# EAGLE design sterowanie (EAGLE 7.2.0)
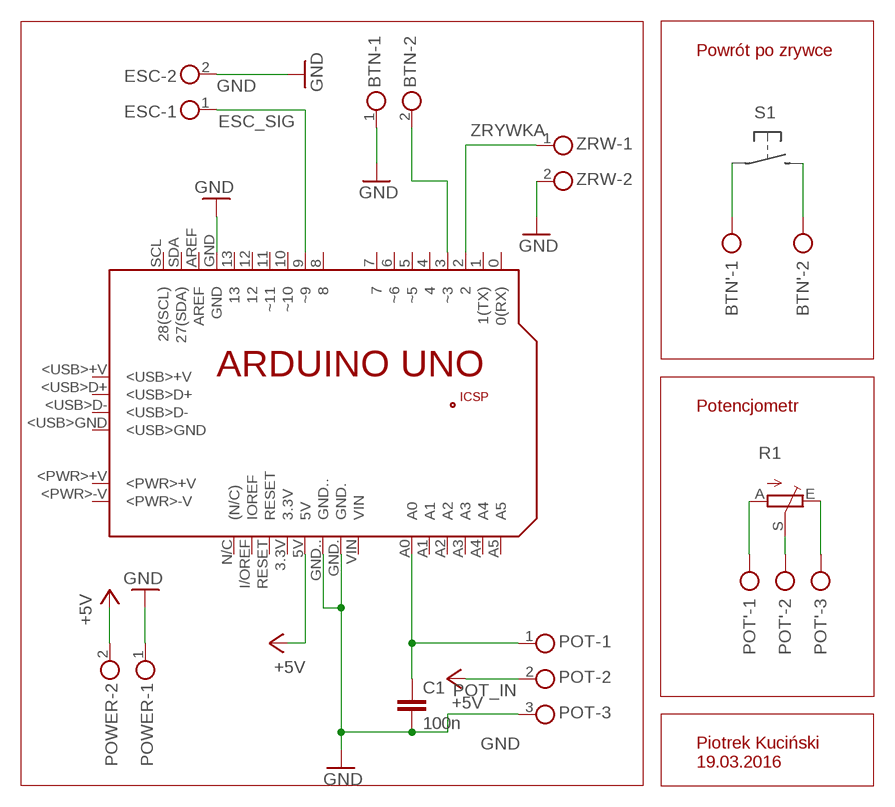
[diagram p0: schematic, sheet 1]

## Parts
BTN  AKL59-02  [2POL35]
BTN'  AK300/2  [AK300/2]
C1  100n  C-EUC1206  [C1206]
ESC  AKL59-02  [2POL35]
PCB1  ARDUINO_UNO  [ARDUINO_UNO]
POT  AKL59-03  [3POL35]
POT'  AK300/3  [AK300/3]
POWER  AKL59-02  [2POL35]
R1  TRIM_EU-B90P  [SP19L]
ZRW  AKL59-02  [2POL35]

## Nets
+5V: PCB1.5V POT.2 POWER.2
ESC_SIG: ESC.1 PCB1.9(~9)
GND: BTN.1 C1.2 ESC.2 PCB1.GND PCB1.GND. PCB1.GND.. POT.3 POWER.1 ZRW.2
N$1: BTN.2 PCB1.3(~3)
N$2: BTN'.1
N$3: BTN'.2
N$4: POT'.3 R1.E
N$5: POT'.1 R1.A
N$6: POT'.2 R1.S
POT_IN: C1.1 PCB1.A0 POT.1
ZRYWKA: PCB1.2 ZRW.1
Unconnected: PCB1.0(0(RX)) PCB1.1(1(TX)) PCB1.3.3V PCB1.4 PCB1.5(~5) PCB1.6(~6) PCB1.7 PCB1.8 PCB1.10(~10) PCB1.11(~11) PCB1.12 PCB1.13 PCB1.+5V PCB1.<PWR>+V PCB1.<PWR>-V PCB1.<USB>+V PCB1.<USB>D+ PCB1.<USB>D- PCB1.<USB>GND PCB1.A1 PCB1.A2 PCB1.A3 PCB1.A4 PCB1.A5 PCB1.AREF PCB1.GND_ PCB1.I/OREF(IOREF) PCB1.MISO PCB1.MOSI PCB1.N/C((N/C)) PCB1.RESET PCB1.RESET. PCB1.SCK PCB1.SCL(28(SCL)) PCB1.SDA(27(SDA)) PCB1.VIN

## Notes on the sheet
- Powrót po zrywce
- Potencjometr
- Piotrek Kuciński
  19.03.2016

## Library data of the parts
BTN ESC POWER ZRW = con-ria-59:AKL59-02: RIA Anschlussklemme Typ 59, Raster 3,5 mm, Polzahl 2
BTN' = con-ptr500:AK300/2: CONNECTOR; OC_FARNELL: unknown; OC_NEWARK: unknown
C1 = rcl:C-EU: CAPACITOR, European symbol
PCB1 = E14_Arduino_revB:ARDUINO_UNO: Device for representing an Arduino Uno board with a footprint in an EAGLE design. Created by Dave Young for Element14. More EAGLE documentation at: http://www.element14.com/community/community/knode/cadsoft_eagle
POT = con-ria-59:AKL59-03: RIA Anschlussklemme Typ 59, Raster 3,5 mm, Polzahl 3
POT' = con-ptr500:AK300/3: CONNECTOR; OC_FARNELL: unknown; OC_NEWARK: unknown
R1 = pot:TRIM_EU-: POTENTIOMETER

## Board
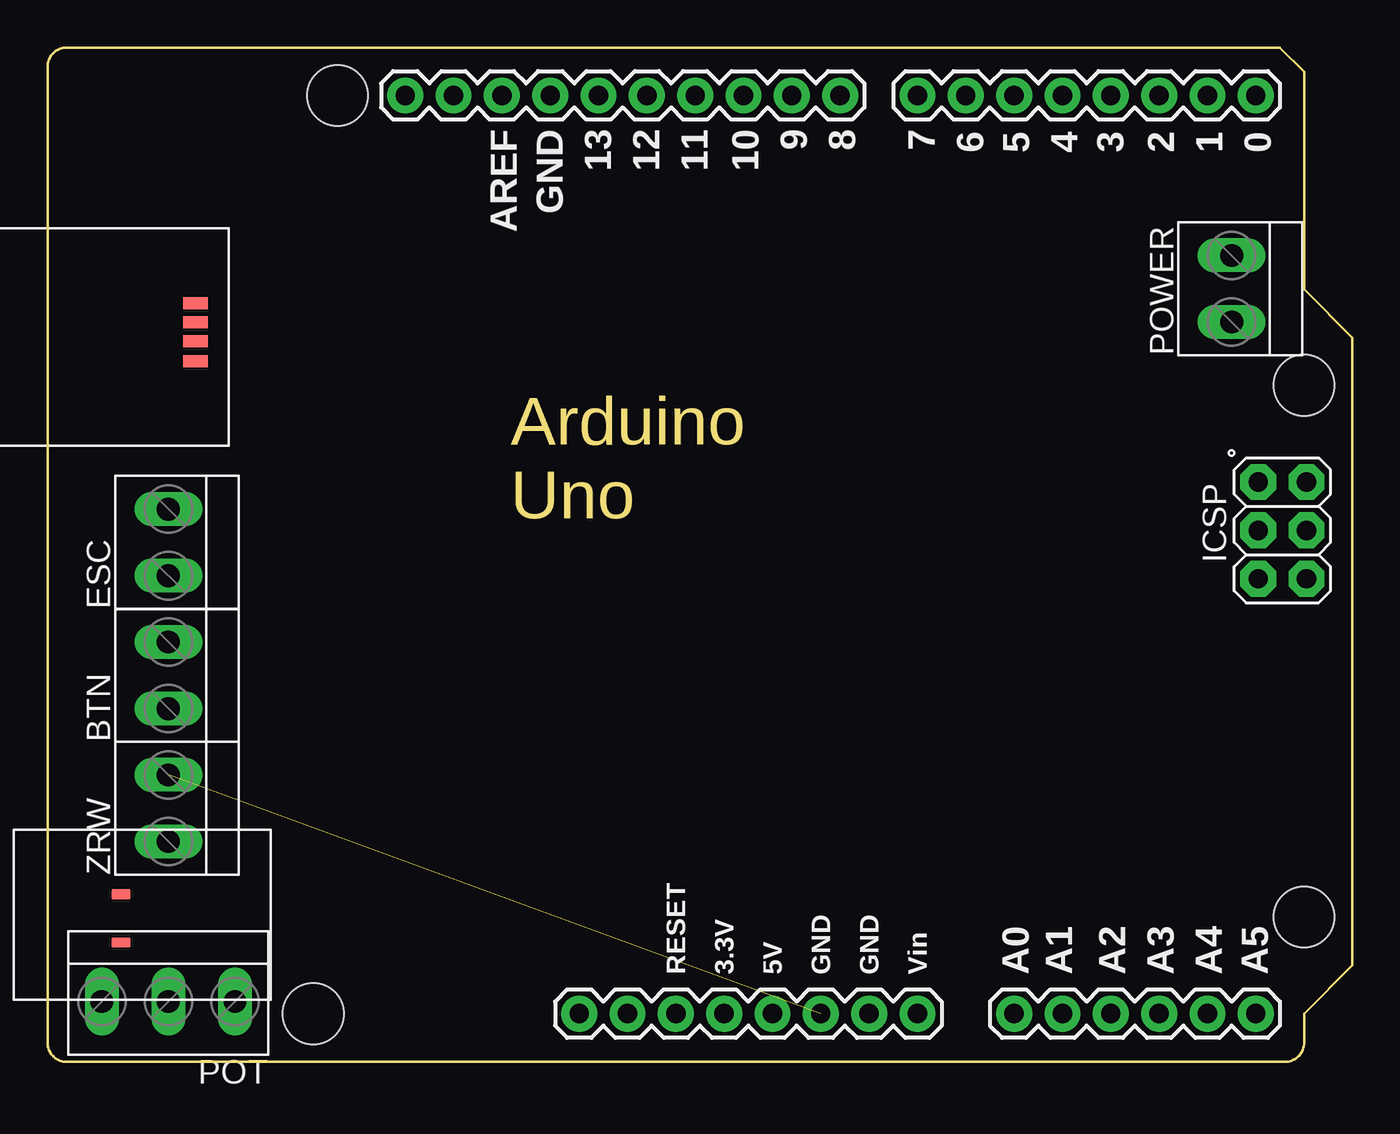
[diagram p1: board, top side]
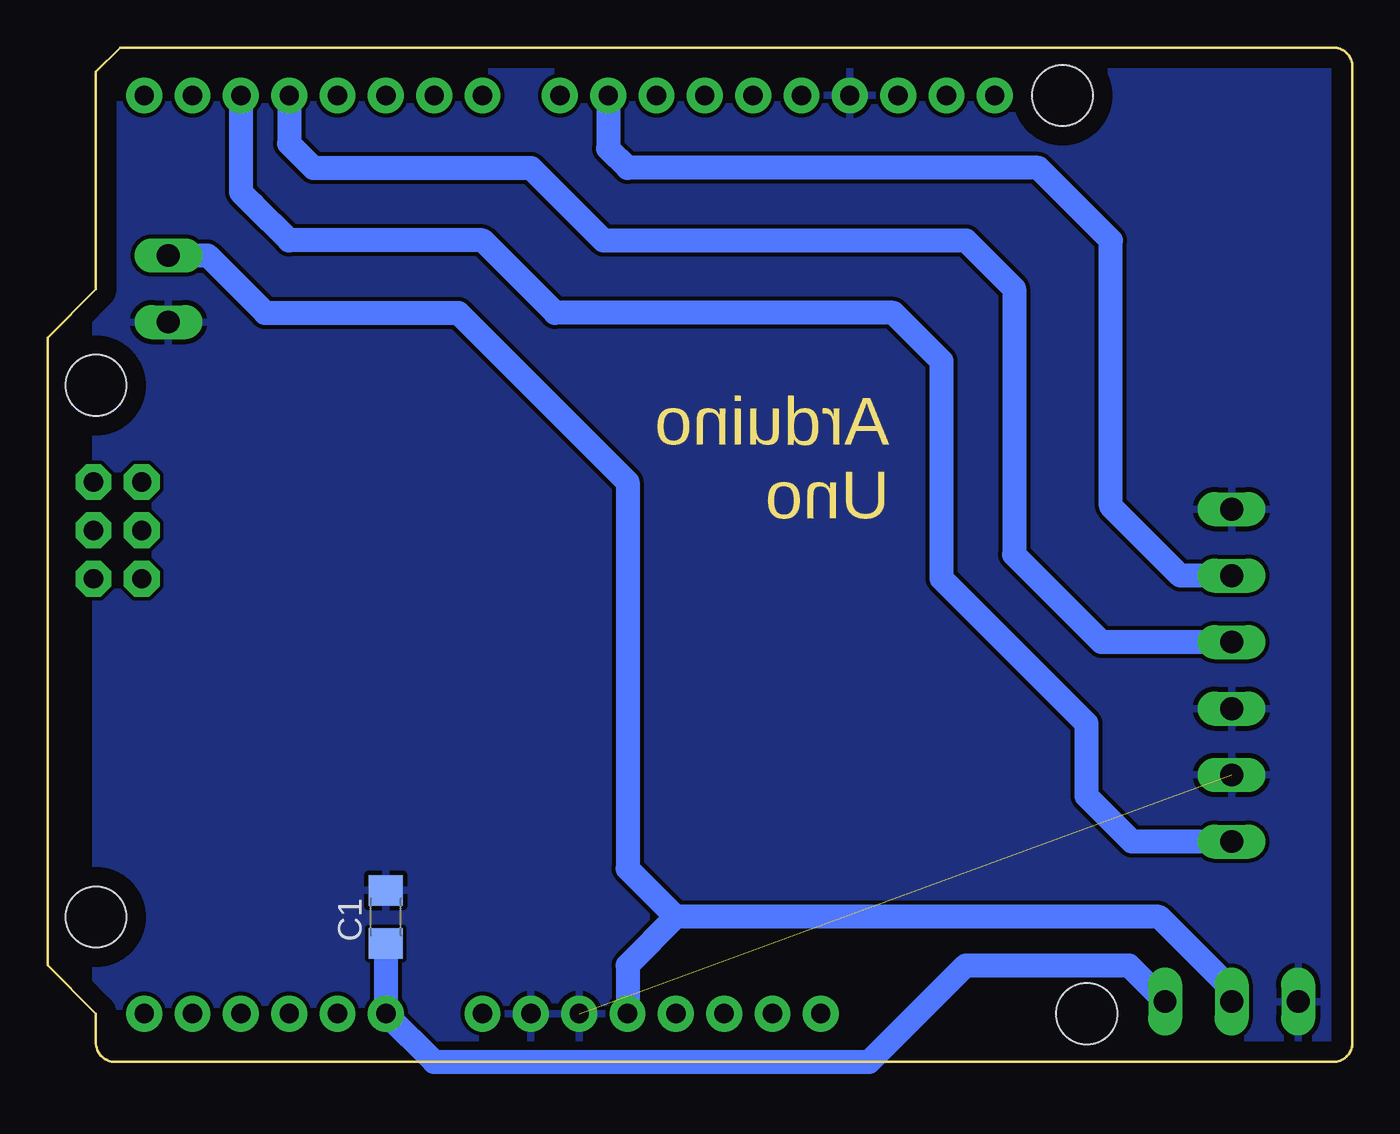
[diagram p2: board, bottom side, seen from below]

Size 68.58 x 53.31 mm. Coordinates in mm from the lower left corner, seen from the top.
Copper layers (1*16): Top 0.035mm / dielectric 1.5mm / Bottom 0.035mm
Design rules "default": minimum track width 10mil, minimum drill 24mil, track to track 8mil, track to pad 8mil, pad to pad 8mil, via to via 8mil, smd to smd 8mil, copper to edge 40mil, drill to drill 8mil, minimum pad ring 10mil, minimum via ring 8mil, stop-mask expansion 4mil, vias tented up to drill 0mil, thermal gap 10mil

### Footprints (pad centres in the part's own frame; a part is rotated, then mirrored left to right if it is on the bottom)
2POL35 = drill 1.2 long: 1 -1.75,0; 2 1.75,0
AK300/2 = drill 1.321 long: 1 -2.515,0; 2 2.489,0
C1206 = smd 1.6 x 1.8: 1 -1.4,0; 2 1.4,0
ARDUINO_UNO = drill 1.016 pad 1.88: 0 63.5,50.8; 1 60.96,50.8; 2 58.42,50.8; 3 55.88,50.8; 3.3V 35.56,2.54; 4 53.34,50.8; 5 50.8,50.8; 5V 38.1,2.54; 6 48.26,50.8; 7 45.72,50.8; 8 41.656,50.8; 9 39.116,50.8; 10 36.576,50.8; 11 34.036,50.8; 12 31.496,50.8; 13 28.956,50.8; A0 50.8,2.54; A1 53.34,2.54; A2 55.88,2.54; A3 58.42,2.54; A4 60.96,2.54; A5 63.5,2.54; AREF 23.876,50.8; GND 26.416,50.8; GND. 43.18,2.54; GND.. 40.64,2.54; I/OREF 30.48,2.54; N/C 27.94,2.54; RESET 33.02,2.54; SCL 18.796,50.8; SDA 21.336,50.8; VIN 45.72,2.54 | drill 1.016 pad 1.88 octagon: +5V 66.167,30.48; GND_ 66.167,25.4; MISO 63.627,30.48; MOSI 66.167,27.94; RESET. 63.627,25.4; SCK 63.627,27.94 | smd 1.016 x 0.508: <PWR>+V 3.861,8.814; <PWR>-V 3.861,6.274 | smd 1.27 x 0.635: <USB>+V 7.772,39.878; <USB>D+ 7.772,38.887; <USB>D- 7.772,37.871; <USB>GND 7.772,36.83 | hole 3.2: 66.04,7.62; 66.04,35.56; 15.24,50.8; 13.97,2.54
3POL35 = drill 1.2 long: 1 -3.5,0; 2 0,0; 3 3.5,0
AK300/3 = drill 1.321 long: 1 -5.004,0; 2 0,0; 3 5.004,0
SP19L = drill 1.016 long: A 5.715,-1.27; E -6.985,-1.27; S -1.905,1.27

### Placement (x,y rotation side)
BTN  6.35,20.32 90 top
BTN'  -63.5,60.96 0 top  (outside the outline)
C1  50.8,7.62 90 bottom
ESC  6.35,27.3 90 top
PCB1  0,0 0 top
POT  6.35,3.17 180 top
POT'  -38.1,60.96 0 top  (outside the outline)
POWER  62.23,40.64 90 top
R1  -46.99,73.66 0 top  (outside the outline)
ZRW  6.35,13.34 90 top

### Tracks (layer width: path | path; a pad name or v marks a point on that pad's centre or on a via)
+5V
  Bottom 1.27: POT.2 6.35,3.81 10.16,7.62 35.56,7.62 | 35.56,7.62 38.1,5.08 PCB1.5V | POWER.2 60.17,42.39 57.15,39.37 46.99,39.37 38.1,30.48 38.1,10.16 35.56,7.62
ESC_SIG
  Bottom 1.27: ESC.1 9.04,25.55 12.7,29.21 12.7,43.18 16.51,46.99 38.1,46.99 39.12,48.01 PCB1.9
GND  (1 unrouted)
  pour Bottom: 0,53.34 66.04,53.34 66.04,-1.27 0,-1.27
N$1
  Bottom 1.27: PCB1.3 55.88,48.26 54.61,46.99 43.18,46.99 39.37,43.18 20.32,43.18 17.78,40.64 17.78,26.67 13.18,22.07 BTN.2
N$4  (1 unrouted)
N$5  (1 unrouted)
N$6  (1 unrouted)
POT_IN
  Bottom 1.27: C1.1 PCB1.A0 48.26,0 25.4,0 20.32,5.08 11.76,5.08 POT.1
ZRYWKA
  Bottom 1.27: ZRW.1 11.59,11.59 13.97,13.97 13.97,17.78 21.59,25.4 21.59,36.83 24.13,39.37 41.91,39.37 45.72,43.18 55.88,43.18 57.78,45.09 58.42,45.72 PCB1.2